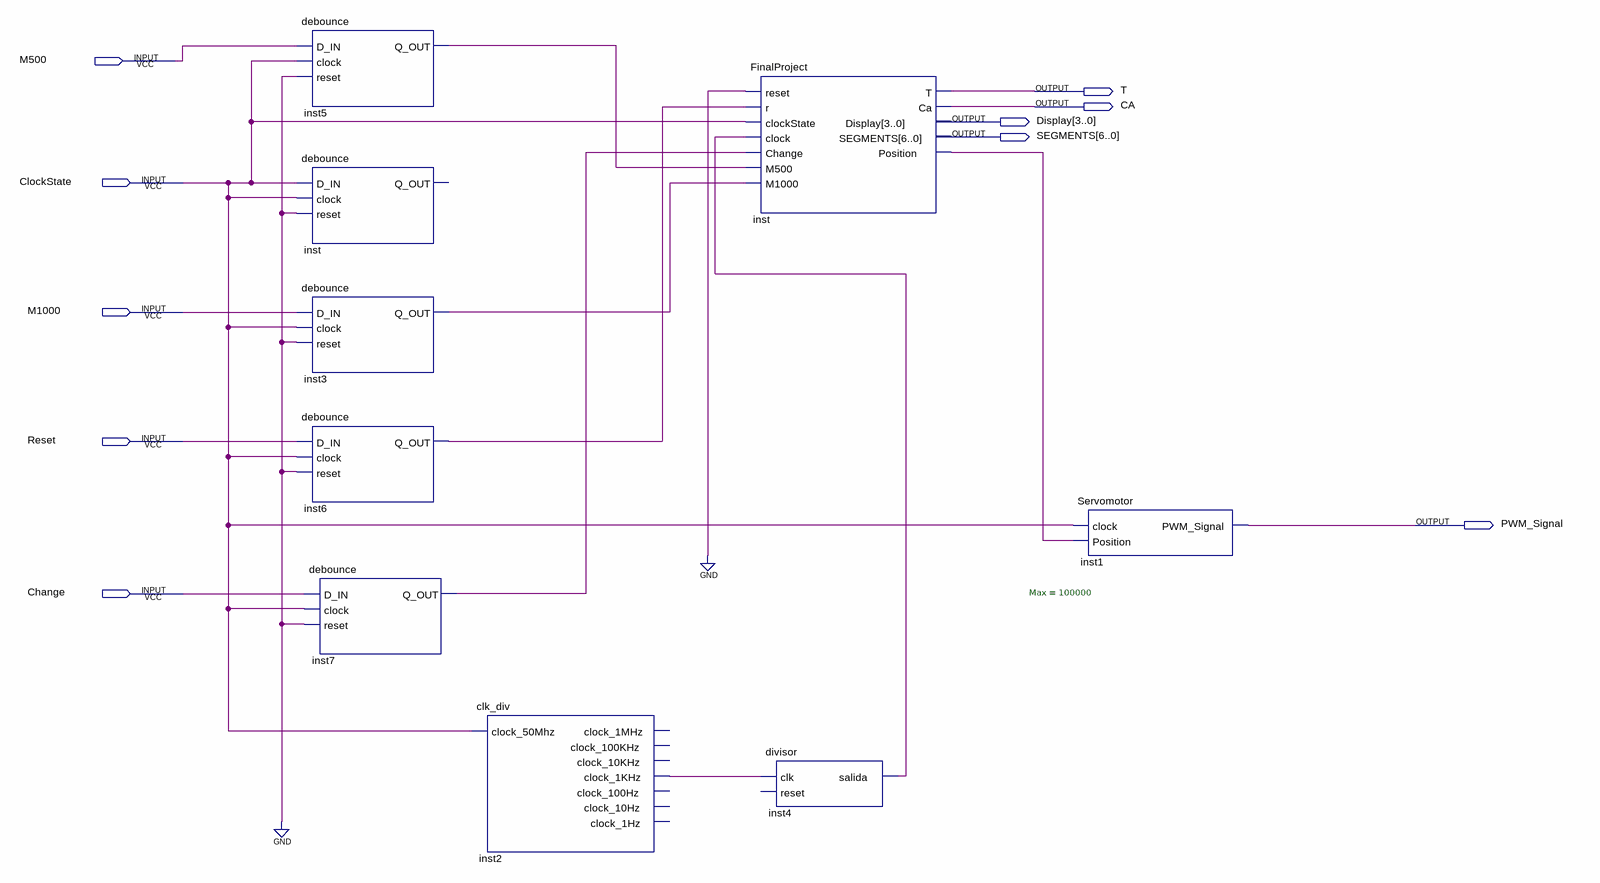
[diagram p0: schematic sheet]
// Quartus schematic DiagramaEsteSi.bdf as structural Verilog: 9 symbols, 10 pins
module DiagramaEsteSi (
  input  M500,
  input  ClockState,
  input  M1000,
  input  Reset,
  input  Change,
  output T,
  output CA,
  output [3:0] Display,
  output [6:0] SEGMENTS,
  output PWM_Signal
);

  wire inst2_clock_1khz, inst3_q_out, inst4_salida, inst5_q_out, inst6_q_out, inst7_q_out, inst_position;

  debounce inst5 (.D_IN(M500), .clock(ClockState), .reset(1'b0), .Q_OUT(inst5_q_out));
  debounce inst (.D_IN(ClockState), .clock(ClockState), .reset(1'b0));  // open: Q_OUT
  debounce inst3 (.D_IN(M1000), .clock(ClockState), .reset(1'b0), .Q_OUT(inst3_q_out));
  debounce inst6 (.D_IN(Reset), .clock(ClockState), .reset(1'b0), .Q_OUT(inst6_q_out));
  debounce inst7 (.D_IN(Change), .clock(ClockState), .reset(1'b0), .Q_OUT(inst7_q_out));
  clk_div inst2 (
    .clock_50Mhz(ClockState), .clock_1KHz(inst2_clock_1khz));  // open: clock_1MHz, clock_100KHz, clock_10KHz, clock_100Hz, clock_10Hz, clock_1Hz
  FinalProject inst_dup2 (
    .reset(1'b0), .r(inst6_q_out), .clockState(ClockState), .clock(inst4_salida), .Change(inst7_q_out),
    .M500(inst5_q_out), .M1000(inst3_q_out), .T(T), .Ca(CA), .Display(Display), .SEGMENTS(SEGMENTS),
    .Position(inst_position));
  divisor inst4 (.clk(inst2_clock_1khz), .salida(inst4_salida));  // open: reset
  Servomotor #(.Max(100000)) inst1 (.clock(ClockState), .Position(inst_position), .PWM_Signal(PWM_Signal));
endmodule
